# EAGLE design octosonar-feather (EAGLE 9.2.2)
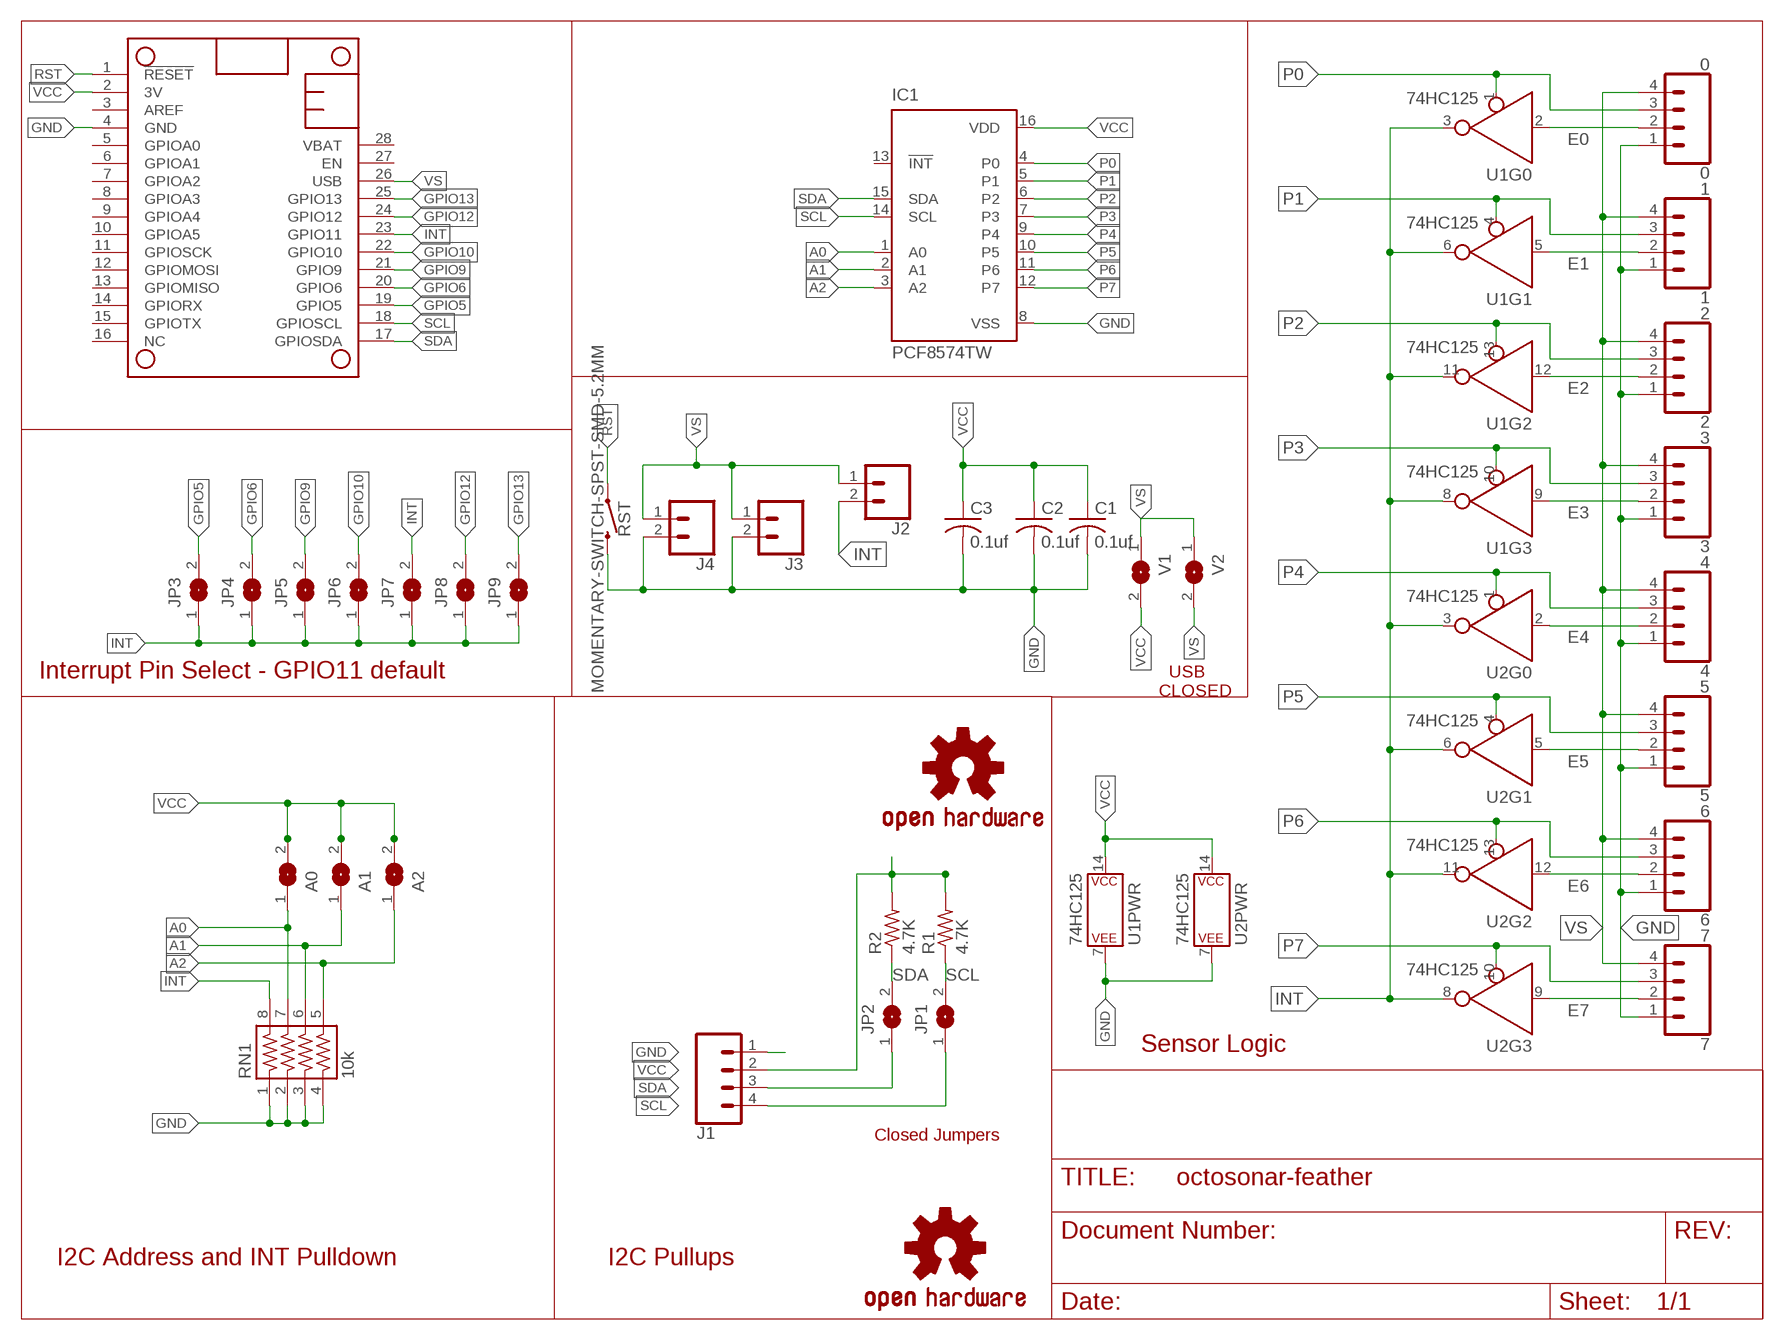
[diagram p0: schematic, sheet 1]

## Parts
0  0  CONN_041X04_NO_SILK  [1X04_NO_SILK]
1  1  CONN_041X04_NO_SILK  [1X04_NO_SILK]
2  2  CONN_041X04_NO_SILK  [1X04_NO_SILK]
3  3  CONN_041X04_NO_SILK  [1X04_NO_SILK]
4  4  CONN_041X04_NO_SILK  [1X04_NO_SILK]
5  5  CONN_041X04_NO_SILK  [1X04_NO_SILK]
6  6  CONN_041X04_NO_SILK  [1X04_NO_SILK]
7  7  CONN_041X04_NO_SILK  [1X04_NO_SILK]
A0  SJSJ-NOCREAM  [SJ-NOCREAM]
A1  SJSJ-NOCREAM  [SJ-NOCREAM]
A2  SJSJ-NOCREAM  [SJ-NOCREAM]
C1  0.1uf  C-USC0603  [C0603]
C2  0.1uf  C-USC0603  [C0603]
C3  0.1uf  C-USC0603  [C0603]
IC1  PCF8574TW  [SO16W]
J1  CONN_041X04_NO_SILK  [1X04_NO_SILK]
J2  CONN_021X02_NO_SILK  [1X02_NO_SILK]
J3  CONN_021X02_NO_SILK  [1X02_NO_SILK]
J4  CONN_021X02_NO_SILK  [1X02_NO_SILK]
JP1  SJSJ-NOCREAM  [SJ-NOCREAM]
JP2  SJSJ-NOCREAM  [SJ-NOCREAM]
JP3  SJSJ-NOCREAM  [SJ-NOCREAM]
JP4  SJSJ-NOCREAM  [SJ-NOCREAM]
JP5  SJSJ-NOCREAM  [SJ-NOCREAM]
JP6  SJSJ-NOCREAM  [SJ-NOCREAM]
JP7  SJSJ-NOCREAM  [SJ-NOCREAM]
JP8  SJSJ-NOCREAM  [SJ-NOCREAM]
JP9  SJSJ-NOCREAM  [SJ-NOCREAM]
LOGO1  OSHW-LOGOL-COPPER  [OSHW-LOGO-L_COPPER]
LOGO2  OSHW-LOGOL  [OSHW-LOGO-L]
MS1  FEATHERWINGFEATHERWING_LONG  [FEATHERWING_LONG]
R1  4.7K  R-US_R0603  [R0603]
R2  4.7K  R-US_R0603  [R0603]
RN1  10k  743-8  [743-8]
RST  MOMENTARY-SWITCH-SPST-SMD-5.2MM  [TACTILE_SWITCH_SMD_5.2MM]
U1  74HC125  74AC125DG  [SO14]
U2  74HC125  74AC125DG  [SO14]
V1  SJSJ-NOCREAM  [SJ-NOCREAM]
V2  SJSJ-NOCREAM  [SJ-NOCREAM]

## Nets
A0: A0.1 IC1.1(A0) RN1.7
A1: A1.1 IC1.2(A1) RN1.6
A2: A2.1 IC1.3(A2) RN1.5
E0: 0.2 U1.2(A)
E1: 1.2 U1.5(A)
E2: 2.2 U1.12(A)
E3: 3.2 U1.9(A)
E4: 4.2 U2.2(A)
E5: 5.2 U2.5(A)
E6: 6.2 U2.12(A)
E7: 7.2 U2.9(A)
GND: 0.1 1.1 2.1 3.1 4.1 5.1 6.1 7.1 C1.2 C2.2 C3.2 IC1.8(VSS) J1.1 J3.2 J4.2 MS1.4(GND) RN1.1 RN1.2 RN1.3 RN1.4 RST.3 U1.7(PWR:P$V-) U2.7(PWR:P$V-)
GPIO5: JP3.2 MS1.19(GPIO5)
GPIO6: JP4.2 MS1.20(GPIO6)
GPIO9: JP5.2 MS1.21(GPIO9)
GPIO10: JP6.2 MS1.22(GPIO10)
GPIO12: JP8.2 MS1.24(GPIO12)
GPIO13: JP9.2 MS1.25(GPIO13)
INT: J2.2 JP3.1 JP4.1 JP5.1 JP6.1 JP7.1 JP7.2 JP8.1 JP9.1 MS1.23(GPIO11) RN1.8 U1.3(Y) U1.6(Y) U1.8(Y) U1.11(Y) U2.3(Y) U2.6(Y) U2.8(Y) U2.11(Y)
P0: 0.3 IC1.4(P0) U1.1(!EN)
P1: 1.3 IC1.5(P1) U1.4(!EN)
P2: 2.3 IC1.6(P2) U1.13(!EN)
P3: 3.3 IC1.7(P3) U1.10(!EN)
P4: 4.3 IC1.9(P4) U2.1(!EN)
P5: 5.3 IC1.10(P5) U2.4(!EN)
P6: 6.3 IC1.11(P6) U2.13(!EN)
P7: 7.3 IC1.12(P7) U2.10(!EN)
RST: MS1.1(!RESET) RST.1
SCL: IC1.14(SCL) J1.4 JP1.1 JP1.2 MS1.18(GPIOSCL) R1.1
SDA: IC1.15(SDA) J1.3 JP2.1 JP2.2 MS1.17(GPIOSDA) R2.1
VCC: A0.2 A1.2 A2.2 C1.1 C2.1 C3.1 IC1.16(VDD) J1.2 MS1.2(3V) R1.2 R2.2 U1.14(PWR:P$V+) U2.14(PWR:P$V+) V1.2
VS: 0.4 1.4 2.4 3.4 4.4 5.4 6.4 7.4 J2.1 J3.1 J4.1 MS1.26(USB) V1.1 V2.1 V2.2
Unconnected: IC1.13(!INT) MS1.3(AREF) MS1.5(GPIOA0) MS1.6(GPIOA1) MS1.7(GPIOA2) MS1.8(GPIOA3) MS1.9(GPIOA4) MS1.10(GPIOA5) MS1.11(GPIOSCK) MS1.12(GPIOMOSI) MS1.13(GPIOMISO) MS1.14(GPIORX) MS1.15(GPIOTX) MS1.16(NC) MS1.27(EN) MS1.28(VBAT)

## Notes on the sheet
- Interrupt Pin Select - GPIO11 default
- USB
  CLOSED
- Sensor Logic
- Closed Jumpers
- I2C Address and INT Pulldown | I2C Pullups

## Library data of the parts
0 1-7 J1 = redhunter:CONN_04: Multi connection point. Often used as Generic Header-pin footprint for 0.1 inch spaced/style header connections On any of the 0.1 inch spaced packages, you can populate with these: Break Away Headers - Straight <https://www.sparkfun.com/products/116> (PRT-00116) Break Away Male Headers - Right Angle <https://www.sparkfun.com/products/553> (PRT-00553) Female Headers <https://www.sparkfun.com/products/115> (PRT-00115) Break Away Headers - Machine Pin <https://www.sparkfun.com/products/117> (PRT-00117) Break Away Female Headers - Swiss Machine Pin <https://www.sparkfun.com/products/743> (PRT-00743) For SCREWTERMINALS and SPRING TERMINALS visit here: Screw Terimnals on SparkFun.com <https://www.sparkfun.com/search/results?term=Screw+Terminals> (5mm/3.5mm/2.54mm spacing) This device is also useful as a general connection point to wire up your design to another part of your project. Our various solder wires solder well into these plated through hole pads. Hook-Up Wire - Assortment (Stranded, 22 AWG) <https://www.sparkfun.com/products/11375> (PRT-11375) Hook-Up Wire - Assortment (Solid Core, 22 AWG) <https://www.sparkfun.com/products/11367> (PRT-11367) View the entire wire category on our website here <https://www.sparkfun.com/categories/141> Special notes: Molex polarized connector foot print use with SKU : PRT-08231 with associated crimp pins and housings. 1MM SMD Version SKU: PRT-10208; PROD_ID: CONN-09696
A0 A1 A2 JP1-JP9 V1 V2 = redhunter:SJ: SMD solder JUMPER
C1-C3 = rcl:C-US: CAPACITOR, American symbol; SPICEPREFIX: C
IC1 = micro-philips:PCF8574: I2C-Bus Remote 8-bit I/O expander http://www.semiconductors.philips.com/acrobat_download/datasheets/PCF8574_4.pdf; MPN: PCF8574T/3,512; OC_FARNELL: 1201255; OC_NEWARK: 70R6870
J2-J4 = redhunter:CONN_02: Multi connection point. Often used as Generic Header-pin footprint for 0.1 inch spaced/style header connections On any of the 0.1 inch spaced packages, you can populate with these: Break Away Headers - Straight <https://www.sparkfun.com/products/116> (PRT-00116) Break Away Male Headers - Right Angle <https://www.sparkfun.com/products/553> (PRT-00553) Female Headers <https://www.sparkfun.com/products/115> (PRT-00115) Break Away Headers - Machine Pin <https://www.sparkfun.com/products/117> (PRT-00117) Break Away Female Headers - Swiss Machine Pin <https://www.sparkfun.com/products/743> (PRT-00743) For SCREWTERMINALS and SPRING TERMINALS visit here: Screw Terimnals on SparkFun.com <https://www.sparkfun.com/search/results?term=Screw+Terminals> (5mm/3.5mm/2.54mm spacing) This device is also useful as a general connection point to wire up your design to another part of your project. Our various solder wires solder well into these plated through hole pads. Hook-Up Wire - Assortment (Stranded, 22 AWG) <https://www.sparkfun.com/products/11375> (PRT-11375) Hook-Up Wire - Assortment (Solid Core, 22 AWG) <https://www.sparkfun.com/products/11367> (PRT-11367) View the entire wire category on our website here <https://www.sparkfun.com/categories/141> Special notes: Molex polarized connector foot print use with: PRT-08233 with associated crimp pins and housings. 2.54_SCREWTERM for use with PRT-10571. 3.5mm Screw Terminal footprints for PRT-08084 5mm Screw Terminal footprints for use with PRT-08432
LOGO1 LOGO2 = SparkFun-Aesthetics:OSHW-LOGO: Open-Source Hardware (OSHW) Logo This logo indicates the piece of hardware it is found on incorporates a OSHW license and/or adheres to the definition of open source hardware found here: http://freedomdefined.org/OSHW
MS1 = redhunter:FEATHERWING
R1 R2 = rcl:R-US_: RESISTOR, American symbol; SPICEPREFIX: R
RN1 = resistor-array:743-8: CTS 743 Series 8 Terminations, 4 Resistors
RST = SparkFun-Switches:MOMENTARY-SWITCH-SPST: Momentary Switch (Pushbutton) - SPST Normally-open (NO) SPST momentary switches (buttons, pushbuttons). Variants PTH-12MM - 12mm square, through-hole Momentary Pushbutton Switch - 12mm Square <https://www.sparkfun.com/products/9190> (COM-09190) PTH-6.0MM, PTH-6.0MM-KIT - 6.0mm square, through-hole Mini Pushbutton Switch <https://www.sparkfun.com/products/97> (COM-00097) KIT package intended for soldering kit's - only one side of pads' copper is exposed. PTH-RIGHT-ANGLE-KIT - Right-angle, through-hole Right Angle Tactile Button <https://www.sparkfun.com/products/10791> - Used on SparkFun BigTime Watch Kit <https://www.sparkfun.com/products/11734> SMD-12MM - 12mm square, surface-mount Tactile Button - SMD (12mm) <https://www.sparkfun.com/products/12993> (COM-12993) Used on SparkFun PicoBoard <https://www.sparkfun.com/products/11888> SMD-4.5MM - 4.5mm Square Trackball Switch Used on SparkFun Blackberry Trackballer Breakout <https://www.sparkfun.com/products/13169> SMD-4.6MMX2.8MM - 4.60mm x 2.80mm, surface mount Used on SparkFun SAMD21 Mini Breakout <https://www.sparkfun.com/products/13664> SMD-5.2MM, SMD-5.2-REDUNDANT - 5.2mm square, surface-mount Mini Pushbutton Switch - SMD <https://www.sparkfun.com/products/8720> (COM-08720) Used on Arduino Pro Mini <https://www.sparkfun.com/products/11114> REDUNDANT package connects both switch circuits together SMD-6.0X3.5MM - 6.0 x 3.5mm, surface mount Momentary Reset Switch SMD <https://www.sparkfun.com/products/8229> (COM-08229) SMD-6.2MM-TALL - 6.2mm square, surface mount Tactile Button - SMD (6mm) <https://www.sparkfun.com/products/12992> Used on SparkFun Digital Sandbox <https://www.sparkfun.com/products/12651> SMD-RIGHT-ANGLE - Right-angle, surface mount Used on SparkFun Block for Intel® Edison - Arduino <https://www.sparkfun.com/products/13036>; PROD_ID: SWCH-08247; SF_SKU: COM-08720
U1 U2 = SparkFun-IC-Logic:74*125: Quad inverter with enable BUFF TRI-ST QD N-INV 14SOIC SparkFun Products Pocket AVR Programmer <https://www.sparkfun.com/products/9825> (PGM-09825) SparkFun Line Follower Array <https://www.sparkfun.com/products/13582> (SEN-13582); PROD_ID: IC-08880; VALUE: MC74AC125DG

## Board
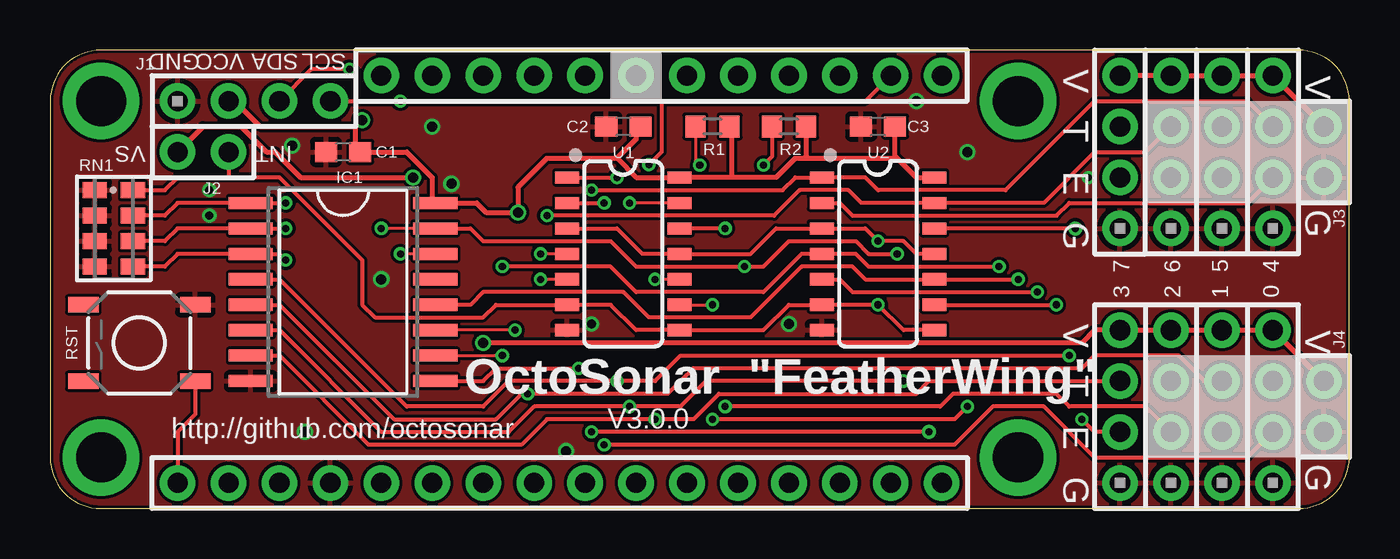
[diagram p1: board, top side]
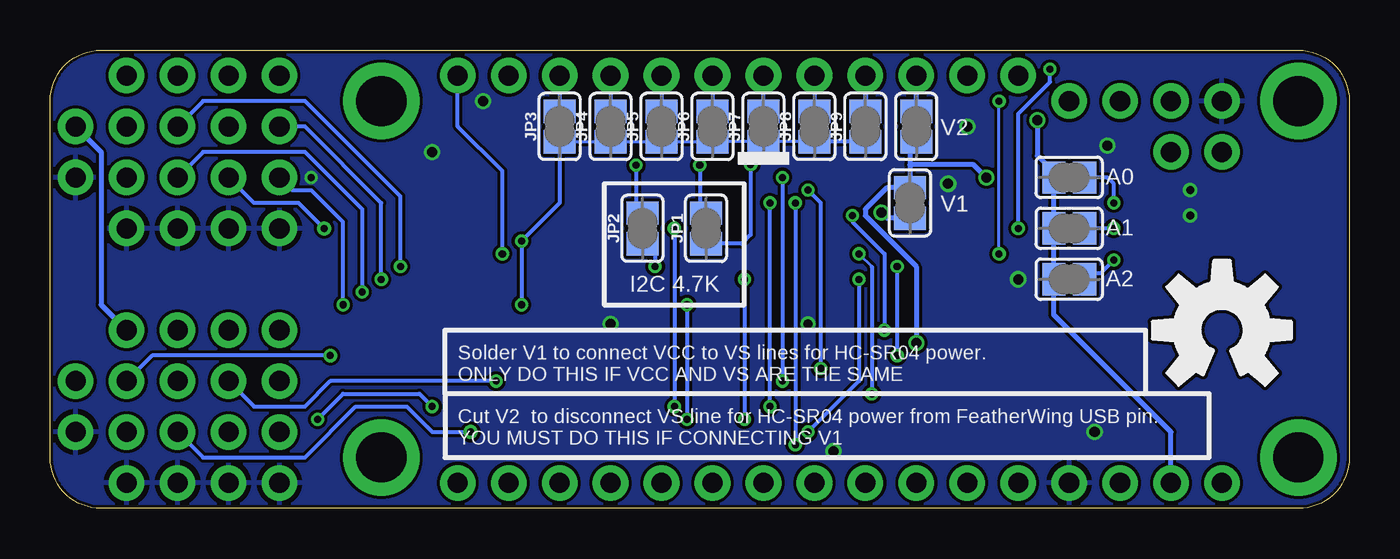
[diagram p2: board, bottom side, seen from below]

Size 64.77 x 22.86 mm. Coordinates in mm from the lower left corner, seen from the top.
Copper layers (1*16): Top 0.035mm / dielectric 1.5mm / Bottom 0.035mm
Design rules "SparkFun-2-layer-PCBWay-LIMIT": minimum track width 6mil, minimum drill 0.3mm, track to track 6mil, track to pad 6mil, pad to pad 6mil, via to via 6mil, smd to smd 6mil, copper to edge 6mil, drill to drill 6mil, minimum pad ring 6mil, minimum via ring 6mil, stop-mask expansion 4mil, vias tented up to drill 25mil, thermal gap 10mil

### Footprints (pad centres in the part's own frame; a part is rotated, then mirrored left to right if it is on the bottom)
1X04_NO_SILK = drill 1 pad 1.778: 1 0,0; 2 2.54,0; 3 5.08,0; 4 7.62,0
SJ-NOCREAM = smd 1.168 x 1.6: 1 -0.762,0; 2 0.762,0
C0603 = smd 1.1 x 1: 1 -0.85,0; 2 0.85,0
SO16W = smd 0.6 x 2.2: 1 -4.445,-4.6; 2 -3.175,-4.6; 3 -1.905,-4.6; 4 -0.635,-4.6; 5 0.635,-4.6; 6 1.905,-4.6; 7 3.175,-4.6; 8 4.445,-4.6; 9 4.445,4.6; 10 3.175,4.6; 11 1.905,4.6; 12 0.635,4.6; 13 -0.635,4.6; 14 -1.905,4.6; 15 -3.175,4.6; 16 -4.445,4.6
1X02_NO_SILK = drill 1 pad 1.778: 1 0,0; 2 2.54,0
FEATHERWING_LONG = drill 1 pad 1.778: 1 6.35,1.27; 2 8.89,1.27; 3 11.43,1.27; 4 13.97,1.27; 5 16.51,1.27; 6 19.05,1.27; 7 21.59,1.27; 8 24.13,1.27; 9 26.67,1.27; 10 29.21,1.27; 11 31.75,1.27; 12 34.29,1.27; 13 36.83,1.27; 14 39.37,1.27; 15 41.91,1.27; 16 44.45,1.27; 17 44.45,21.59; 18 41.91,21.59; 19 39.37,21.59; 20 36.83,21.59; 21 34.29,21.59; 22 31.75,21.59; 23 29.21,21.59; 24 26.67,21.59; 25 24.13,21.59; 26 21.59,21.59; 27 19.05,21.59; 28 16.51,21.59 | drill 2.5 pad 3.81: P$1 2.54,20.32; P$2 2.54,2.54; P$3 48.26,2.54; P$4 48.26,20.32
R0603 = smd 1 x 1.1: 1 -0.85,0; 2 0.85,0
743-8 = smd 0.8 x 1.2: 1 -1.905,-0.953; 2 -0.635,-0.953; 3 0.635,-0.953; 4 1.905,-0.953; 5 1.905,0.953; 6 0.635,0.953; 7 -0.635,0.953; 8 -1.905,0.953
TACTILE_SWITCH_SMD_5.2MM = smd 1.524 x 0.762: 1 -2.794,1.905; 2 2.794,1.905; 3 -2.794,-1.905; 4 2.794,-1.905
SO14 = smd 0.6 x 1.2: 1 -3.175,-2.8; 2 -1.905,-2.8; 3 -0.635,-2.8; 4 0.635,-2.8; 5 1.905,-2.8; 6 3.175,-2.8; 7 4.445,-2.8; 8 4.445,2.8; 9 3.175,2.8; 10 1.905,2.8; 11 0.635,2.8; 12 -0.635,2.8; 13 -1.905,2.8; 14 -3.175,2.8

### Placement (x,y rotation side)
0  60.96,1.27 90 top
1  58.42,1.27 90 top
2  55.88,1.27 90 top
3  53.34,1.27 90 top
4  60.96,13.97 90 top
5  58.42,13.97 90 top
6  55.88,13.97 90 top
7  53.34,13.97 90 top
A0  13.97,16.51 180 bottom
A1  13.97,13.97 180 bottom
A2  13.97,11.43 180 bottom
C1  14.61,17.78 180 top
C2  28.57,19.05 180 top
C3  41.27,19.05 180 top
IC1  14.61,10.79 270 top
J1  6.35,20.32 0 top
J2  6.35,17.78 0 top
J3  63.5,19.05 270 top
J4  63.5,6.35 270 top
JP1  32.07,13.97 90 bottom
JP2  35.24,13.97 90 bottom
JP3  39.37,19.05 90 bottom
JP4  36.83,19.05 90 bottom
JP5  34.29,19.05 90 bottom
JP6  31.75,19.05 90 bottom
JP7  29.21,19.05 90 bottom
JP8  26.67,19.05 90 bottom
JP9  24.13,19.05 90 bottom
LOGO1  6.35,8.89 0 bottom
LOGO2  6.35,8.89 0 bottom
MS1  0,0 0 top
R1  33.02,19.05 0 top
R2  36.83,19.05 0 top
RN1  3.17,13.97 270 top
RST  4.45,8.26 180 top
U1  28.57,13.34 270 top
U2  41.27,13.34 270 top
V1  21.91,15.24 270 bottom
V2  21.59,19.05 90 bottom

### Tracks (layer width: path | path; a pad name or v marks a point on that pad's centre or on a via)
A0  (via drill 0.35)
  Top 0.203: RN1.7 5.71,14.61 6.35,15.24 IC1.1 v11.75,15.24
  Bottom 0.203: v11.75,15.24 11.75,16.19 12.06,16.51 A0.1
A1  (via drill 0.35)
  Top 0.203: RN1.6 5.71,13.34 6.35,13.97 IC1.2 v11.75,13.97
  Bottom 0.203: v11.75,13.97 A1.1
A2  (via drill 0.35)
  Top 0.203: RN1.5 5.71,12.06 6.35,12.7 IC1.3 11.43,12.7 v11.75,12.38
  Bottom 0.203: v11.75,12.38 12.38,11.75 12.89,11.75
  Bottom 0.254: A2.1 12.89,11.75
E0  (via drill 0.35)
  Top 0.203: U1.2 v27.62,15.24 | v27.62,3.17 45.09,3.17 46.99,5.08 49.53,5.08 52.07,2.54 59.69,2.54 0.2
  Bottom 0.203: v27.62,15.24 v27.62,3.17
E1  (via drill 0.35, 0.35 pad 0.7)
  Top 0.152: U1.5 v24.45,11.43
  Top 0.203: v43.81,3.81 v26.99,3.81
  Bottom 0.203: 1.2 57.15,2.54 52.07,2.54 49.53,5.08 46.99,5.08 45.72,3.81 v43.81,3.81 | v24.45,11.43 24.45,6.35 v26.99,3.81
E2  (via drill 0.35)
  Top 0.203: v33.66,5.08 44.37,5.08 45.01,5.71 50.16,5.71 50.8,5.08 54.61,5.08 2.2 | v33.66,13.97 U1.12
  Bottom 0.203: v33.66,13.97 v33.66,5.08
E3  (via drill 0.35)
  Top 0.152: U1.9 v33.02,10.16
  Top 0.203: 3.2 52.07,3.81 v51.44,4.45 | v33.02,4.45 45.09,4.45 v45.72,5.08
  Bottom 0.203: v51.44,4.45 50.16,5.71 46.35,5.71 v45.72,5.08 | v33.02,10.16 v33.02,4.45
E4
  Top 0.203: 4.2 59.69,15.24 50.8,15.24 50.16,14.61 40.01,14.61 39.37,15.24 U2.2
E5  (via drill 0.35)
  Top 0.203: v49.21,10.79 40.01,10.79 39.37,11.43 U2.5
  Bottom 0.203: 5.2 57.15,17.78 52.07,17.78 49.21,14.92 v49.21,10.79
E6  (via drill 0.35 pad 0.7)
  Top 0.203: v51.12,13.97 U2.12
  Bottom 0.203: v51.12,13.97 52.39,15.24 54.61,15.24 6.2
E7  (via drill 0.35)
  Top 0.203: U2.9 v50.16,10.16
  Bottom 0.203: 7.2 52.7,15.88 51.75,15.88 50.16,14.29 v50.16,10.16
GND  (via drill 0.35, 0.4, 0.45, 0.5)
  other vias: 43.18,20.32 36.83,9.21 26.99,9.21 51.75,16.51 45.72,17.78 19.05,19.05 12.06,18.1 20,16.19 7.94,15.88 7.94,14.61 16.51,11.43 12.7,3.81 25.72,2.86
  pour Top: 0,0 64.77,0 64.77,22.86 0,22.86
  pour Bottom: 0,22.86 0,0 64.77,0 64.77,22.86
GPIO5
  Bottom 0.203: MS1.19 JP3.2
GPIO6
  Bottom 0.203: MS1.20 JP4.2
GPIO9
  Bottom 0.203: MS1.21 JP5.2
GPIO10
  Bottom 0.203: MS1.22 JP6.2
GPIO12
  Bottom 0.203: MS1.24 JP8.2
GPIO13
  Bottom 0.254: MS1.25 JP9.2
INT  (via drill 0.35)
  Top 0.203: U2.8 42.55,8.89 v41.27,10.16 U2.6 36.83,10.16 35.56,8.89 U1.8 29.21,8.89 27.94,10.16 U1.6 22.23,10.16 21.59,9.53 16.19,9.53 15.56,10.16 15.56,12.38 11.43,16.51 8.89,16.51 | U2.11 43.18,12.7 42.55,13.34 v41.27,13.34 40.64,13.97 U2.3 36.2,13.97 34.92,12.7 U1.11 29.53,12.7 28.26,13.97 U1.3 | 8.89,16.51 6.35,16.51 5.71,15.88 RN1.8 | J2.2 8.89,16.51
  Bottom 0.152: JP8.1 JP7.1 | JP7.1 JP6.1 JP5.1 JP4.1 JP3.1 | JP7.2 JP7.1
  Bottom 0.203: v41.27,10.16 v41.27,13.34 39.37,15.24 JP3.1 | JP7.2 MS1.23 | JP9.1 JP8.1
P0  (via drill 0.35)
  Top 0.203: IC1.4 11.43,11.43 17.78,5.08 21.59,5.08 22.86,6.35 v28.26,6.35 30.16,6.35 31.43,7.62 v50.8,7.62 | U1.1 v28.26,16.51
  Bottom 0.203: 0.3 59.69,7.62 v50.8,7.62 | v28.26,16.51 v28.26,6.35
P1  (via drill 0.35)
  Top 0.152: U1.4 v24.45,12.7
  Top 0.203: IC1.5 11.43,10.16 17.14,4.45 22.23,4.45 23.5,5.71 v23.81,5.71 30.78,5.71 31.42,6.35 31.43,6.35 32.07,6.99 51.44,6.99 52.07,7.62 56.26,7.62 57.53,6.35 1.3
  Bottom 0.152: v24.45,12.7 23.81,12.06
  Bottom 0.203: 23.81,12.06 v23.81,5.71
P2  (via drill 0.35)
  Top 0.152: U1.13 v28.89,15.24
  Top 0.203: IC1.6 11.43,8.89 16.51,3.81 22.86,3.81 24.13,5.08 v28.89,5.08 31.43,5.08 32.7,6.35 v42.55,6.35
  Bottom 0.203: 2.3 54.61,5.08 52.07,5.08 50.8,6.35 v42.55,6.35 | v28.89,5.08 v28.89,15.24
P3  (via drill 0.35)
  Top 0.152: U1.10 v30.16,11.43
  Top 0.203: IC1.7 11.43,7.62 15.88,3.17 23.5,3.17 24.77,4.45 v30.16,4.45 32.07,4.45 33.34,5.71 43.18,5.71 43.81,6.35 3.3
  Bottom 0.203: v30.16,11.43 v30.16,4.45
P4  (via drill 0.35)
  Top 0.203: 4.3 59.69,20.32 52.07,20.32 47.62,15.88 41.27,15.88 40.64,16.51 U2.1 37.15,16.51 36.51,15.88 v26.99,15.88 | IC1.9 21.59,6.35 22.23,6.99 v26.35,6.99
  Bottom 0.203: v26.35,6.99 26.35,15.24 v26.99,15.88
P5  (via drill 0.35)
  Top 0.152: IC1.10 v22.54,7.62
  Top 0.203: v47.31,12.06 40.81,12.06 40.17,12.7 U2.4 37.47,12.7 35.56,10.79 29.21,10.79 27.94,12.06 v22.54,12.06
  Bottom 0.203: 5.3 57.15,20.32 52.07,20.32 47.31,15.56 v47.31,12.06 | v22.54,12.06 v22.54,7.62
P6  (via drill 0.35)
  Top 0.152: v23.18,8.89 IC1.11
  Top 0.203: v24.77,14.61 36.09,14.61 37.36,15.88 39.8,15.88 40.44,15.24 U2.13 49.53,15.24 52.07,17.78 54.61,17.78 6.3
  Bottom 0.203: v24.77,14.61 24.77,14.29 23.18,12.7 v23.18,8.89
P7  (via drill 0.35)
  Top 0.203: v48.26,11.43 U2.10 40.64,11.43 40.01,12.06 37.47,12.06 34.92,9.53 29.84,9.53 28.57,10.79 21.59,10.79 20.95,10.16 IC1.12
  Bottom 0.203: v48.26,11.43 48.26,15.24 52.07,19.05 7.3
RST
  Top 0.203: RST.1 7.24,4.7 6.35,3.81 MS1.1
SCL  (via drill 0.35)
  Top 0.152: IC1.14 v17.46,12.7 | R1.1 32.17,17.33 v32.38,17.12
  Top 0.203: MS1.18 40.64,20.32 30.48,20.32 | J1.4 v17.46,20.32 30.48,20.32 | 30.48,20.32 30.48,17.78 v29.84,17.14
  Bottom 0.152: v17.46,12.7 v17.46,20.32 | 32.38,15.05 JP1.2 JP1.1
  Bottom 0.203: v29.84,17.14 29.84,13.65 30.29,13.21 JP1.1 | v32.38,17.12 32.38,15.05
SDA  (via drill 0.35)
  Top 0.152: IC1.15 v16.51,13.97
  Top 0.203: IC1.15 20.95,13.97 21.59,13.34 27.94,13.34 29.21,12.06 v34.61,12.06 35.56,12.06 36.83,13.34 40.17,13.34 40.81,12.7 v42.23,12.7 | v14.92,21.91 13.02,21.91 J1.3 | R2.1 35.98,17.54 v35.56,17.12
  Bottom 0.152: 34.61,13.21 JP2.1 JP2.2 35.56,15.05
  Bottom 0.203: 34.61,13.21 v34.61,12.06 | v42.23,12.7 42.23,16.83 44.45,19.05 MS1.17 | v16.51,13.97 16.51,19.68 14.92,21.27 v14.92,21.91 | v35.56,17.12 35.56,15.05
VCC  (via drill 0.5)
  Top 0.254: 28.25,17.46 29.21,16.51 U1.14 33.97,16.51 | 42.23,17.46 43.18,16.51 U2.14 | J1.2 9.21,20.32 10.48,19.05 15.24,19.05 | 28.25,17.46 24.77,17.46 23.32,16.02 v23.32,14.76 21.75,14.76 21.27,15.24 IC1.16 19.05,15.24 19.05,16.51 17.78,17.78 C1.1 15.24,18 15.24,19.05 | 37.78,17.46 37.15,17.46 36.2,16.51 33.97,16.51 | 37.78,17.46 42.23,17.46 | R2.2 37.68,17.57 37.78,17.46 | 15.24,19.05 v15.56,19.37 | R1.2 33.97,18.95 33.97,16.51 | 28.25,17.46 29.2,18.41 29.21,18.41 29.21,18.84 C2.1 | 42.23,17.46 42.12,17.57 C3.1
  Bottom 0.254: MS1.2 8.89,3.81 14.73,9.65 A2.2 A1.2 A0.2 14.61,16.64 15.56,17.59 v15.56,19.37 | V1.2 23.04,14.48 v23.32,14.76
VS  (via drill 0.5)
  Top 0.254: J3.1 4.4 5.4 6.4 7.4 | v21.59,8.26 51.44,8.26 52.07,8.89 3.4 2.4 1.4 0.4 J4.1 | v18.09,16.5 v18.09,16.51 12.49,16.51 11.22,17.78 10.79,17.78 9.53,19.05 7.62,19.05 J2.1
  Bottom 0.254: J3.1 62.23,17.78 62.23,10.16 0.4 | 21.91,17.14 21.91,17.97 V2.1 V2.2 MS1.26 | v21.59,8.26 21.59,12.06 24.13,14.61 24.13,14.92 23.05,16 V1.1 21.91,17.14 | v18.09,16.5 18.74,17.14 21.91,17.14

### Text on the board
tPlace: GND | VCC | SDA | SCL | V | V | T | VS | INT | E | G | G | V | V | T | OctoSonar "FeatherWing" | V3.0.0 | E | http://github.com/octosonar | G | G
bPlace: I2C 4.7K | Solder V1 to connect VCC to VS lines for HC-SR04 power. / ONLY DO THIS IF VCC AND VS ARE THE SAME | Cut V2 to disconnect VS line for HC-SR04 power from FeatherWing USB pin. / YOU MUST DO THIS IF CONNECTING V1